# Altium project ScanningCaptureCard.PrjPcb
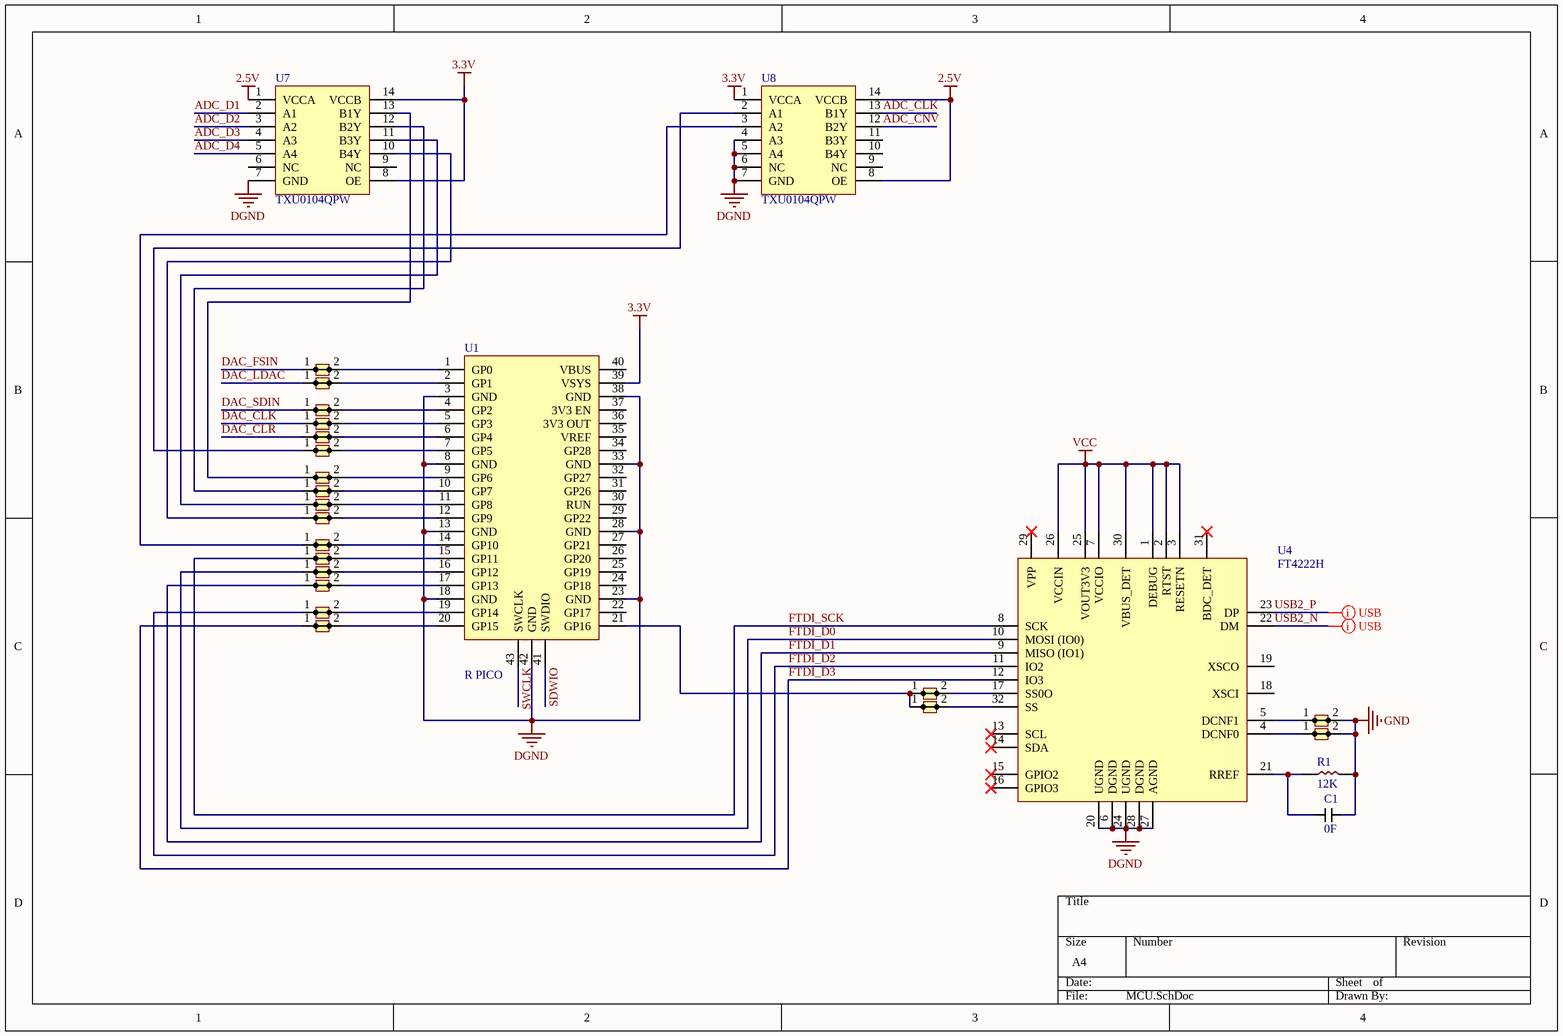
[diagram p0: MCU.SchDoc]
5 sheets, 74 parts. Net scope: global (net labels, ports and power ports of the same name join across sheets).
Board file: ScanningCaptureCard.PcbDoc
Sheets:
  MCU.SchDoc
  DAC.SchDoc
  ADC.SchDoc
  VREF.SchDoc
  POWER.SchDoc

## Sheet MCU.SchDoc
size A4; SheetNumber: 1; SheetTotal: 5

### Parts
C1  0F  [C0805]
R1  12K  [R0805]
SB1  SolderBridge  [SB]  (value not drawn)
SB2  SolderBridge  [SB]  (value not drawn)
SB3  SolderBridge  [SB]  (value not drawn)
SB4  SolderBridge  [SB]  (value not drawn)
SB5  SolderBridge  [SB]  (value not drawn)
SB6  SolderBridge  [SB]  (value not drawn)
SB7  SolderBridge  [SB]  (value not drawn)
SB8  SolderBridge  [SB]  (value not drawn)
SB9  SolderBridge  [SB]  (value not drawn)
SB10  SolderBridge  [SB]  (value not drawn)
SB11  SolderBridge  [SB]  (value not drawn)
SB12  SolderBridge  [SB]  (value not drawn)
SB13  SolderBridge  [SB]  (value not drawn)
SB14  SolderBridge  [SB]  (value not drawn)
SB15  SolderBridge  [SB]  (value not drawn)
SB16  SolderBridge  [SB]  (value not drawn)
SB17  SolderBridge  [SB]  (value not drawn)
SB18  SolderBridge  [SB]  (value not drawn)
SB19  SolderBridge  [SB]  (value not drawn)
SB20  SolderBridge  [SB]  (value not drawn)
U1  R PICO  [RPICO]
U4  FT4222H  [QFN-32]
U7  TXU0104QPW  [TSOP-14]
U8  TXU0104QPW  [TSOP-14]

### Nets
2.5V: U7.1(VCCA) U8.8(OE) U8.14(VCCB)
3.3V: U1.39(VSYS) U7.8(OE) U7.14(VCCB) U8.1(VCCA)
DGND: U1.3(GND) U1.8(GND) U1.13(GND) U1.18(GND) U1.23(GND) U1.28(GND) U1.33(GND) U1.38(GND) U1.42(GND) U4.6(DGND) U4.20(UGND) U4.24(UGND) U4.27(AGND) U4.28(DGND) U7.7(GND) U8.4(A3) U8.5(A4) U8.6(NC) U8.7(GND)
GND: C1.2 R1.2 SB19.2 SB20.2
USB2_N: U4.22(DM)
USB2_P: U4.23(DP)
VCC: U4.1(DEBUG) U4.2(RTST) U4.3(RESETN) U4.7(VCCIO) U4.25(VOUT3V3) U4.26(VCCIN) U4.30(VBUS_DET)
ADC_CLK: U8.13(B1Y)
ADC_CNV: U8.12(B2Y)
ADC_D1: U7.2(A1)
ADC_D2: U7.3(A2)
ADC_D3: U7.4(A3)
ADC_D4: U7.5(A4)
DAC_CLK: SB4.1
DAC_CLR: SB5.1
DAC_FSIN: SB1.1
DAC_LDAC: SB2.1
DAC_SDIN: SB3.1
FTDI_D0: SB13.1 U4.10(MOSI_(IO0))
FTDI_D1: SB14.1 U4.9(MISO_(IO1))
FTDI_D2: SB15.1 U4.11(IO2)
FTDI_D3: SB16.1 U4.12(IO3)
FTDI_SCK: SB12.1 U4.8(SCK)
SDWIO: U1.41(SWDIO)
SWCLK: U1.43(SWCLK)
NetC1_1: C1.1 R1.1 U4.21(RREF)
NetSB1_2: SB1.2 U1.1(GP0)
NetSB2_2: SB2.2 U1.2(GP1)
NetSB3_2: SB3.2 U1.4(GP2)
NetSB4_2: SB4.2 U1.5(GP3)
NetSB5_2: SB5.2 U1.6(GP4)
NetSB6_1: SB6.1 U8.2(A1)
NetSB6_2: SB6.2 U1.7(GP5)
NetSB7_1: SB7.1 U7.13(B1Y)
NetSB7_2: SB7.2 U1.9(GP6)
NetSB8_1: SB8.1 U7.12(B2Y)
NetSB8_2: SB8.2 U1.10(GP7)
NetSB9_1: SB9.1 U7.11(B3Y)
NetSB9_2: SB9.2 U1.11(GP8)
NetSB10_1: SB10.1 U7.10(B4Y)
NetSB10_2: SB10.2 U1.12(GP9)
NetSB11_1: SB11.1 U8.3(A2)
NetSB11_2: SB11.2 U1.14(GP10)
NetSB12_2: SB12.2 U1.15(GP11)
NetSB13_2: SB13.2 U1.16(GP12)
NetSB14_2: SB14.2 U1.17(GP13)
NetSB15_2: SB15.2 U1.19(GP14)
NetSB16_2: SB16.2 U1.20(GP15)
NetSB17_1: SB17.1 SB18.1 U1.21(GP16)
NetSB17_2: SB17.2 U4.17(SS0O)
NetSB18_2: SB18.2 U4.32(SS)
NetSB19_1: SB19.1 U4.5(DCNF1)
NetSB20_1: SB20.1 U4.4(DCNF0)

Not connected (* = marked no-connect by the designer): U1 22(GP17) 24(GP18) 25(GP19) 26(GP20) 27(GP21) 29(GP22) 30(RUN) 31(GP26) 32(GP27) 34(GP28) 35(VREF) 36(3V3_OUT) 37(3V3_EN) 40(VBUS); U4 13(SCL)* 14(SDA)* 15(GPIO2)* 16(GPIO3)* 18(XSCI) 19(XSCO) 29(VPP)* 31(BDC_DET)*; U7 6(NC) 9(NC); U8 9(NC) 10(B4Y) 11(B3Y)

### Layout directives
differential pair; differential pair class USB; rule Matched Net Lengths [Tolerance = 2mm]: USB2_N, USB2_P

### Library data of the parts
C1 = C0805: Capacitance: 0F
R1 = R0805: Resistance: 12K
U1 = RaspPico
U4 = FT4222H: USB2.0 to QuadSPI/I2C / Bridge IC; Supplier 1: Mouser; Supplier Part Number 1: 895-FT4222H-R
U7 U8 = TXU0104QPW: Supplier 1: Digi-Key; Supplier 2: Mouser; Supplier Part Number 1: 296-TXU0104QPWRQ1CT-ND; Supplier Part Number 2: 595-TXU0104QPWRQ1

## Sheet DAC.SchDoc
size A4; SheetNumber: 2; SheetTotal: 5
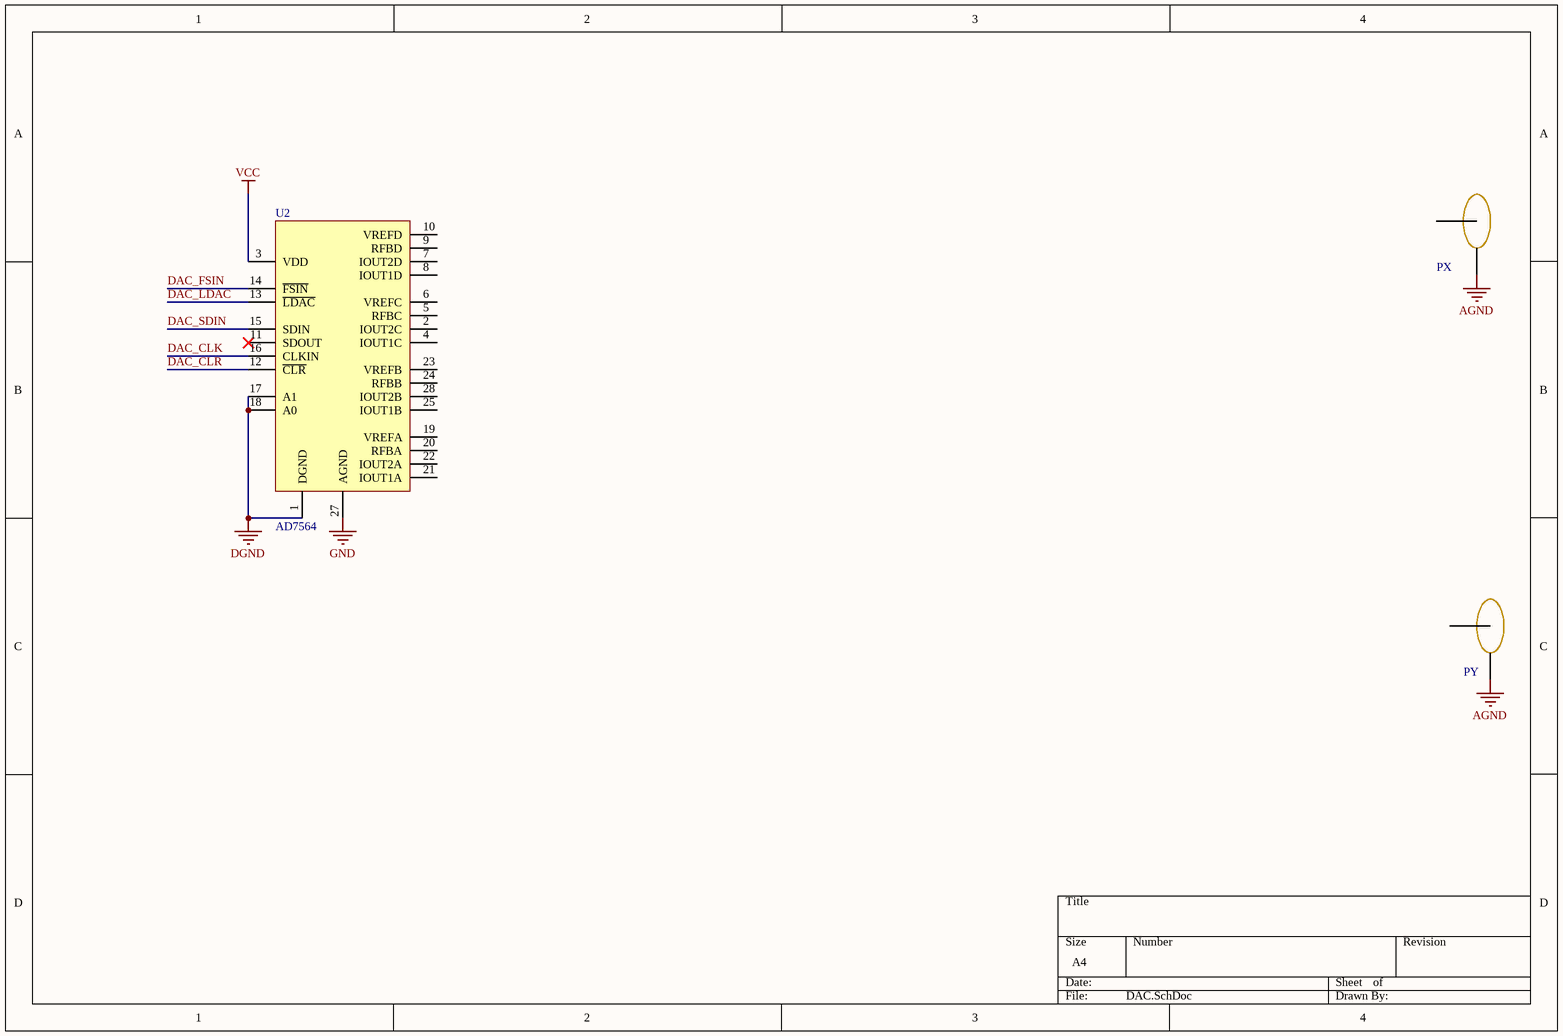
[diagram p1: DAC.SchDoc]

### Parts
PX  PCB.SMAFRA.HT  [PCB.SMAFRA.HT]  (value not drawn)
PY  PCB.SMAFRA.HT  [PCB.SMAFRA.HT]  (value not drawn)
U2  AD7564  [AD7564]

### Nets
AGND: PX.S PY.S
DGND: U2.1(DGND) U2.17(A1) U2.18(A0)
GND: U2.27(AGND)
VCC: U2.3(VDD)
DAC_CLK: U2.16(CLKIN)
DAC_CLR: U2.12(~{CLR})
DAC_FSIN: U2.14(~{FSIN})
DAC_LDAC: U2.13(~{LDAC})
DAC_SDIN: U2.15(SDIN)

Not connected (* = marked no-connect by the designer): PX 1; PY 1; U2 2(IOUT2C) 4(IOUT1C) 5(RFBC) 6(VREFC) 7(IOUT2D) 8(IOUT1D) 9(RFBD) 10(VREFD) 11(SDOUT)* 19(VREFA) 20(RFBA) 21(IOUT1A) 22(IOUT2A) 23(VREFB) 24(RFBB) 25(IOUT1B) 28(IOUT2B)

### Library data of the parts
U2 = AD7564: +3.3 V/+5 V, Low Power, Quad 12-Bit DAC
PX PY = PCB.SMAFRA.HT: Supplier 1: Digi-Key; Supplier 2: Mouser; Supplier Part Number 2: 960-PCB.SMAFRA.HT; Supplier Part Number 1: 931-1361-ND

## Sheet ADC.SchDoc
size A4; SheetNumber: 3; SheetTotal: 5
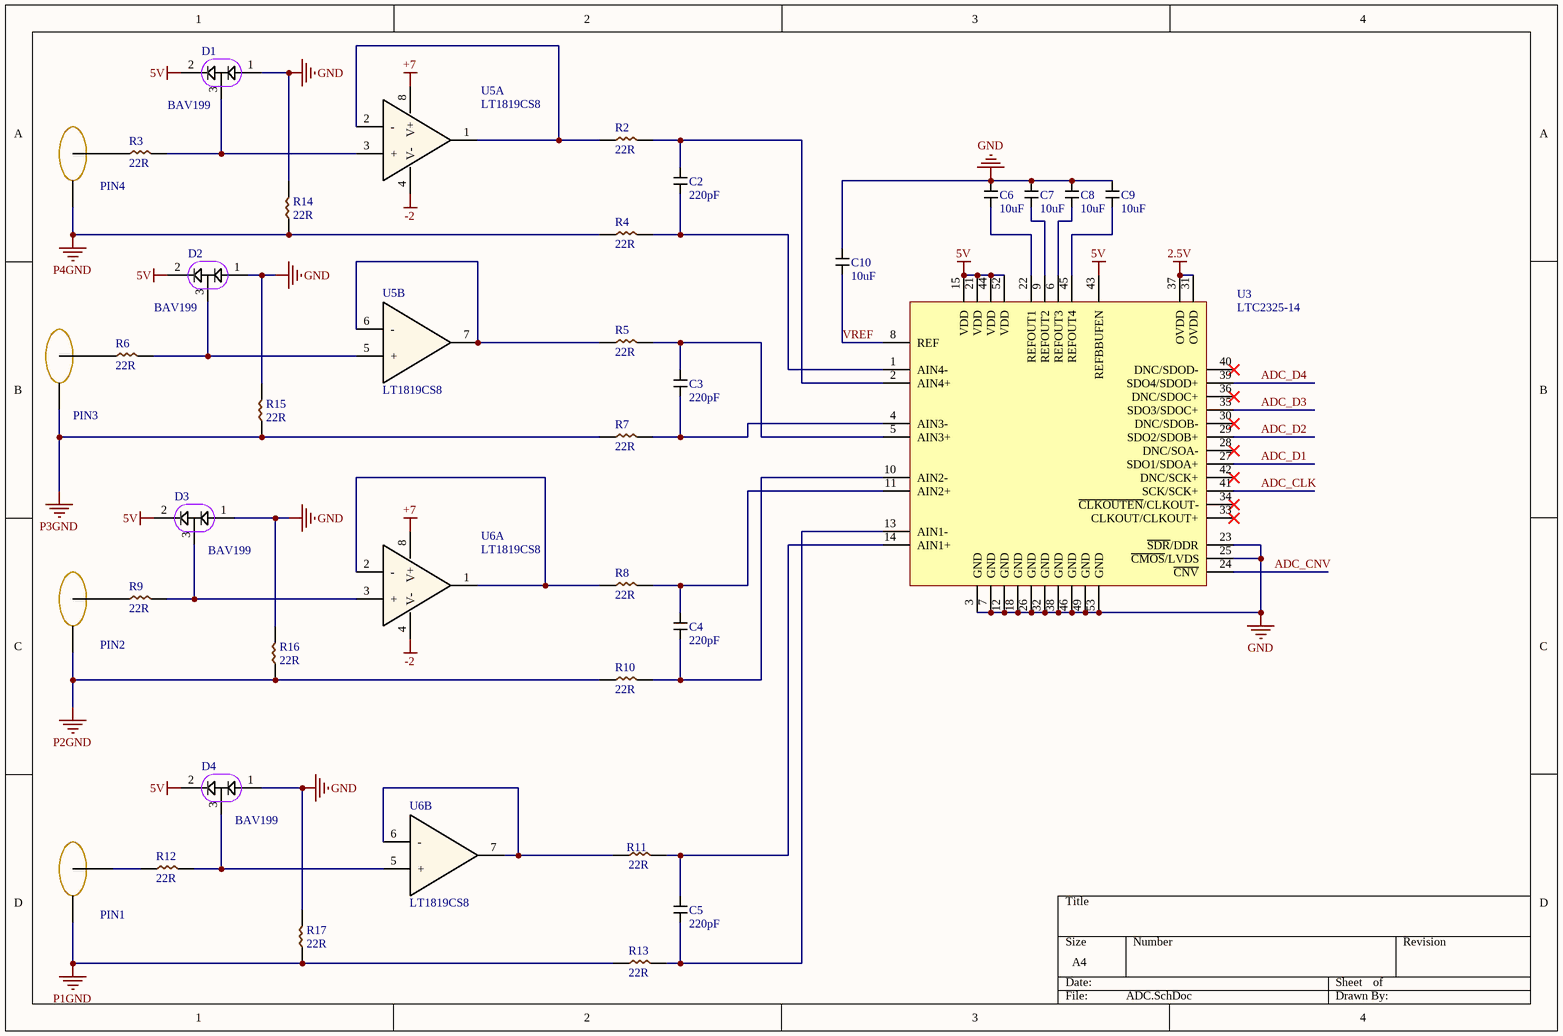
[diagram p2: ADC.SchDoc]

### Parts
C2  220pF  [C0805]
C3  220pF  [C0805]
C4  220pF  [C0805]
C5  220pF  [C0805]
C6  10uF  [C0805]
C7  10uF  [C0805]
C8  10uF  [C0805]
C9  10uF  [C0805]
C10  10uF  [C0805]
D1  BAV199  [SOT23-3]
D2  BAV199  [SOT23-3]
D3  BAV199  [SOT23-3]
D4  BAV199  [SOT23-3]
PIN1  PCB.SMAFRA.HT  [PCB.SMAFRA.HT]  (value not drawn)
PIN2  PCB.SMAFRA.HT  [PCB.SMAFRA.HT]  (value not drawn)
PIN3  PCB.SMAFRA.HT  [PCB.SMAFRA.HT]  (value not drawn)
PIN4  PCB.SMAFRA.HT  [PCB.SMAFRA.HT]  (value not drawn)
R2  22R  [R0805]
R3  22R  [R0805]
R4  22R  [R0805]
R5  22R  [R0805]
R6  22R  [R0805]
R7  22R  [R0805]
R8  22R  [R0805]
R9  22R  [R0805]
R10  22R  [R0805]
R11  22R  [R0805]
R12  22R  [R0805]
R13  22R  [R0805]
R14  22R  [R0805]
R15  22R  [R0805]
R16  22R  [R0805]
R17  22R  [R0805]
U3  LTC2325-14  [QFN-52]
U5  LT1819CS8  [SOIC-8]  (parts A,B of 2)
U6  LT1819CS8  [SOIC-8]  (parts A,B of 2)

### Nets
2.5V: U3.31(OVDD) U3.37(OVDD)
5V: D1.2 D2.2 D3.2 D4.2 U3.15(VDD) U3.21(VDD) U3.43(REFBBUFEN) U3.44(VDD) U3.52(VDD)
+7: U5.8(V+) U6.8(V+)
-2: U5.4(V-) U6.4(V-)
GND: C6.2 C7.2 C8.2 C9.2 C10.2 D1.1 D2.1 D3.1 D4.1 R14.2 R15.2 R16.2 R17.2 U3.3(GND) U3.7(GND) U3.12(GND) U3.18(GND) U3.23(~{SDR}/DDR) U3.25(~{CMOS}/LVDS) U3.26(GND) U3.32(GND) U3.38(GND) U3.46(GND) U3.49(GND) U3.53(GND)
P1GND: PIN1.S R13.1 R17.1
P2GND: PIN2.S R10.1 R16.1
P3GND: PIN3.S R7.1 R15.1
P4GND: PIN4.S R4.1 R14.1
ADC_CLK: U3.41(SCK/SCK+)
ADC_CNV: U3.24(~{CNV})
ADC_D1: U3.27(SDO1/SDOA+)
ADC_D2: U3.29(SDO2/SDOB+)
ADC_D3: U3.35(SDO3/SDOC+)
ADC_D4: U3.39(SDO4/SDOD+)
VREF: C10.1 U3.8(REF)
NetC2_1: C2.1 R4.2 U3.1(AIN4-)
NetC2_2: C2.2 R2.2 U3.2(AIN4+)
NetC3_1: C3.1 R7.2 U3.4(AIN3-)
NetC3_2: C3.2 R5.2 U3.5(AIN3+)
NetC4_1: C4.1 R10.2 U3.10(AIN2-)
NetC4_2: C4.2 R8.2 U3.11(AIN2+)
NetC5_1: C5.1 R13.2 U3.13(AIN1-)
NetC5_2: C5.2 R11.2 U3.14(AIN1+)
NetC6_1: C6.1 U3.22(REFOUT1)
NetC7_1: C7.1 U3.9(REFOUT2)
NetC8_1: C8.1 U3.6(REFOUT3)
NetC9_1: C9.1 U3.45(REFOUT4)
NetD1_3: D1.3 R3.2 U5.3(+)
NetD2_3: D2.3 R6.2 U5.5(+)
NetD3_3: D3.3 R9.2 U6.3(+)
NetD4_3: D4.3 R12.2 U6.5(+)
NetPIN1_1: PIN1.1 R12.1
NetPIN2_1: PIN2.1 R9.1
NetPIN3_1: PIN3.1 R6.1
NetPIN4_1: PIN4.1 R3.1
NetR2_1: R2.1 U5.1 U5.2(-)
NetR5_1: R5.1 U5.6(-) U5.7
NetR8_1: R8.1 U6.1 U6.2(-)
NetR11_1: R11.1 U6.6(-) U6.7

Not connected (* = marked no-connect by the designer): U3 28(DNC/SOA-)* 30(DNC/SDOB-)* 33(CLKOUT/CLKOUT+)* 34(~{CLKOUTEN}/CLKOUT-)* 36(DNC/SDOC+)* 40(DNC/SDOD-)* 42(DNC/SCK+)*

### Library data of the parts
C2-C10 = C0805
  C2-C5: Capacitance: 220pF
  C6-C10: Capacitance: 10uF
R2-R17 = R0805: Resistance: 22R
U3 = LTC2325-14: Quad, 14-Bit + Sign, 5Msps/Ch / Simultaneous Sampling ADC
D1-D4 = BAV199: Supplier 1: Digi-Key; Supplier 2: Mouser; Supplier Part Number 1: BAV199E6327HTSA1CT-ND; Supplier Part Number 2: 726-BAV199E6327HTSA1
PIN1-PIN4 = PCB.SMAFRA.HT: Supplier 1: Digi-Key; Supplier 2: Mouser; Supplier Part Number 2: 960-PCB.SMAFRA.HT; Supplier Part Number 1: 931-1361-ND
U5 U6 = LT1819CS8: Supplier 1: Digi-Key; Supplier Part Number 1: LT1819CS8#TRPBFCT-ND

## Sheet VREF.SchDoc
size A4; SheetNumber: 4; SheetTotal: 4

## Sheet POWER.SchDoc
size A4; SheetNumber: 5; SheetTotal: 5
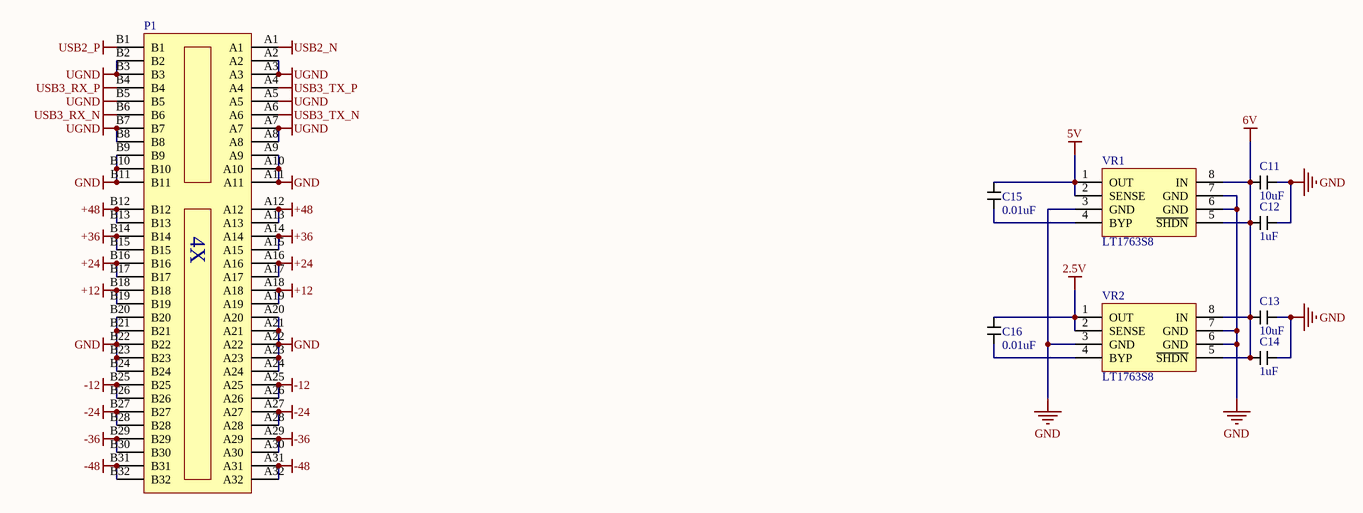
[diagram p3: POWER.SchDoc]

### Parts
C11  10uF  [C0805]
C12  1uF  [C0805]
C13  10uF  [C0805]
C14  1uF  [C0805]
C15  0.01uF  [C0805]
C16  0.01uF  [C0805]
P1  10018783-10201TLF  [PCIe4X]  (value not drawn)
VR1  LT1763S8  [SOIC-8]
VR2  LT1763S8  [SOIC-8]

### Nets
2.5V: C16.1 VR2.1(OUT) VR2.2(SENSE)
5V: C15.1 VR1.1(OUT) VR1.2(SENSE)
6V: C11.2 C12.2 C13.2 C14.2 VR1.5(~{SHDN}) VR1.8(IN) VR2.5(~{SHDN}) VR2.8(IN)
+12: P1.A18 P1.A19 P1.B18 P1.B19
+24: P1.A16 P1.A17 P1.B16 P1.B17
+36: P1.A14 P1.A15 P1.B14 P1.B15
+48: P1.A12 P1.A13 P1.B12 P1.B13
-12: P1.A25 P1.A26 P1.B25 P1.B26
-24: P1.A27 P1.A28 P1.B27 P1.B28
-36: P1.A29 P1.A30 P1.B29 P1.B30
-48: P1.A31 P1.A32 P1.B31 P1.B32
GND: C11.1 C12.1 C13.1 C14.1 P1.A9 P1.A10 P1.A11 P1.A20 P1.A21 P1.A22 P1.A23 P1.A24 P1.B9 P1.B10 P1.B11 P1.B20 P1.B21 P1.B22 P1.B23 P1.B24 VR1.3(GND) VR1.6(GND) VR1.7(GND) VR2.3(GND) VR2.6(GND) VR2.7(GND)
UGND: P1.A2 P1.A3 P1.A5 P1.A7 P1.A8 P1.B2 P1.B3 P1.B5 P1.B7 P1.B8
USB2_N: P1.A1
USB2_P: P1.B1
USB3_RX_N: P1.B6
USB3_RX_P: P1.B4
USB3_TX_N: P1.A6
USB3_TX_P: P1.A4
NetC15_2: C15.2 VR1.4(BYP)
NetC16_2: C16.2 VR2.4(BYP)

### Notes on the sheet
- (in symbol 10018783-10201TLF) 4X

### Library data of the parts
C11-C16 = C0805
  C11 C13: Capacitance: 10uF
  C12 C14: Capacitance: 1uF
  C15 C16: Capacitance: 0.01uF
P1 = 10018783-10201TLF: PCIe 4x; Supplier 1: Digi-Key; Supplier Part Number 1: 609-1964-ND

## Nets that join several sheets
2.5V: MCU (U7.1 U8.8 U8.14), ADC (U3.31 U3.37), POWER (C16.1 VR2.1 VR2.2)
5V: ADC (9 pins), POWER (C15.1 VR1.1 VR1.2)
DGND: MCU (19 pins), DAC (U2.1 U2.17 U2.18)
GND: MCU (C1.2 R1.2 SB19.2 SB20.2), DAC (U2.27), ADC (25 pins), POWER (26 pins)
USB2_N: MCU (U4.22), POWER (P1.A1)
USB2_P: MCU (U4.23), POWER (P1.B1)
VCC: MCU (7 pins), DAC (U2.3)
ADC_CLK: MCU (U8.13), ADC (U3.41)
ADC_CNV: MCU (U8.12), ADC (U3.24)
ADC_D1: MCU (U7.2), ADC (U3.27)
ADC_D2: MCU (U7.3), ADC (U3.29)
ADC_D3: MCU (U7.4), ADC (U3.35)
ADC_D4: MCU (U7.5), ADC (U3.39)
DAC_CLK: MCU (SB4.1), DAC (U2.16)
DAC_CLR: MCU (SB5.1), DAC (U2.12)
DAC_FSIN: MCU (SB1.1), DAC (U2.14)
DAC_LDAC: MCU (SB2.1), DAC (U2.13)
DAC_SDIN: MCU (SB3.1), DAC (U2.15)